# EAGLE design main (EAGLE 8.0.1)
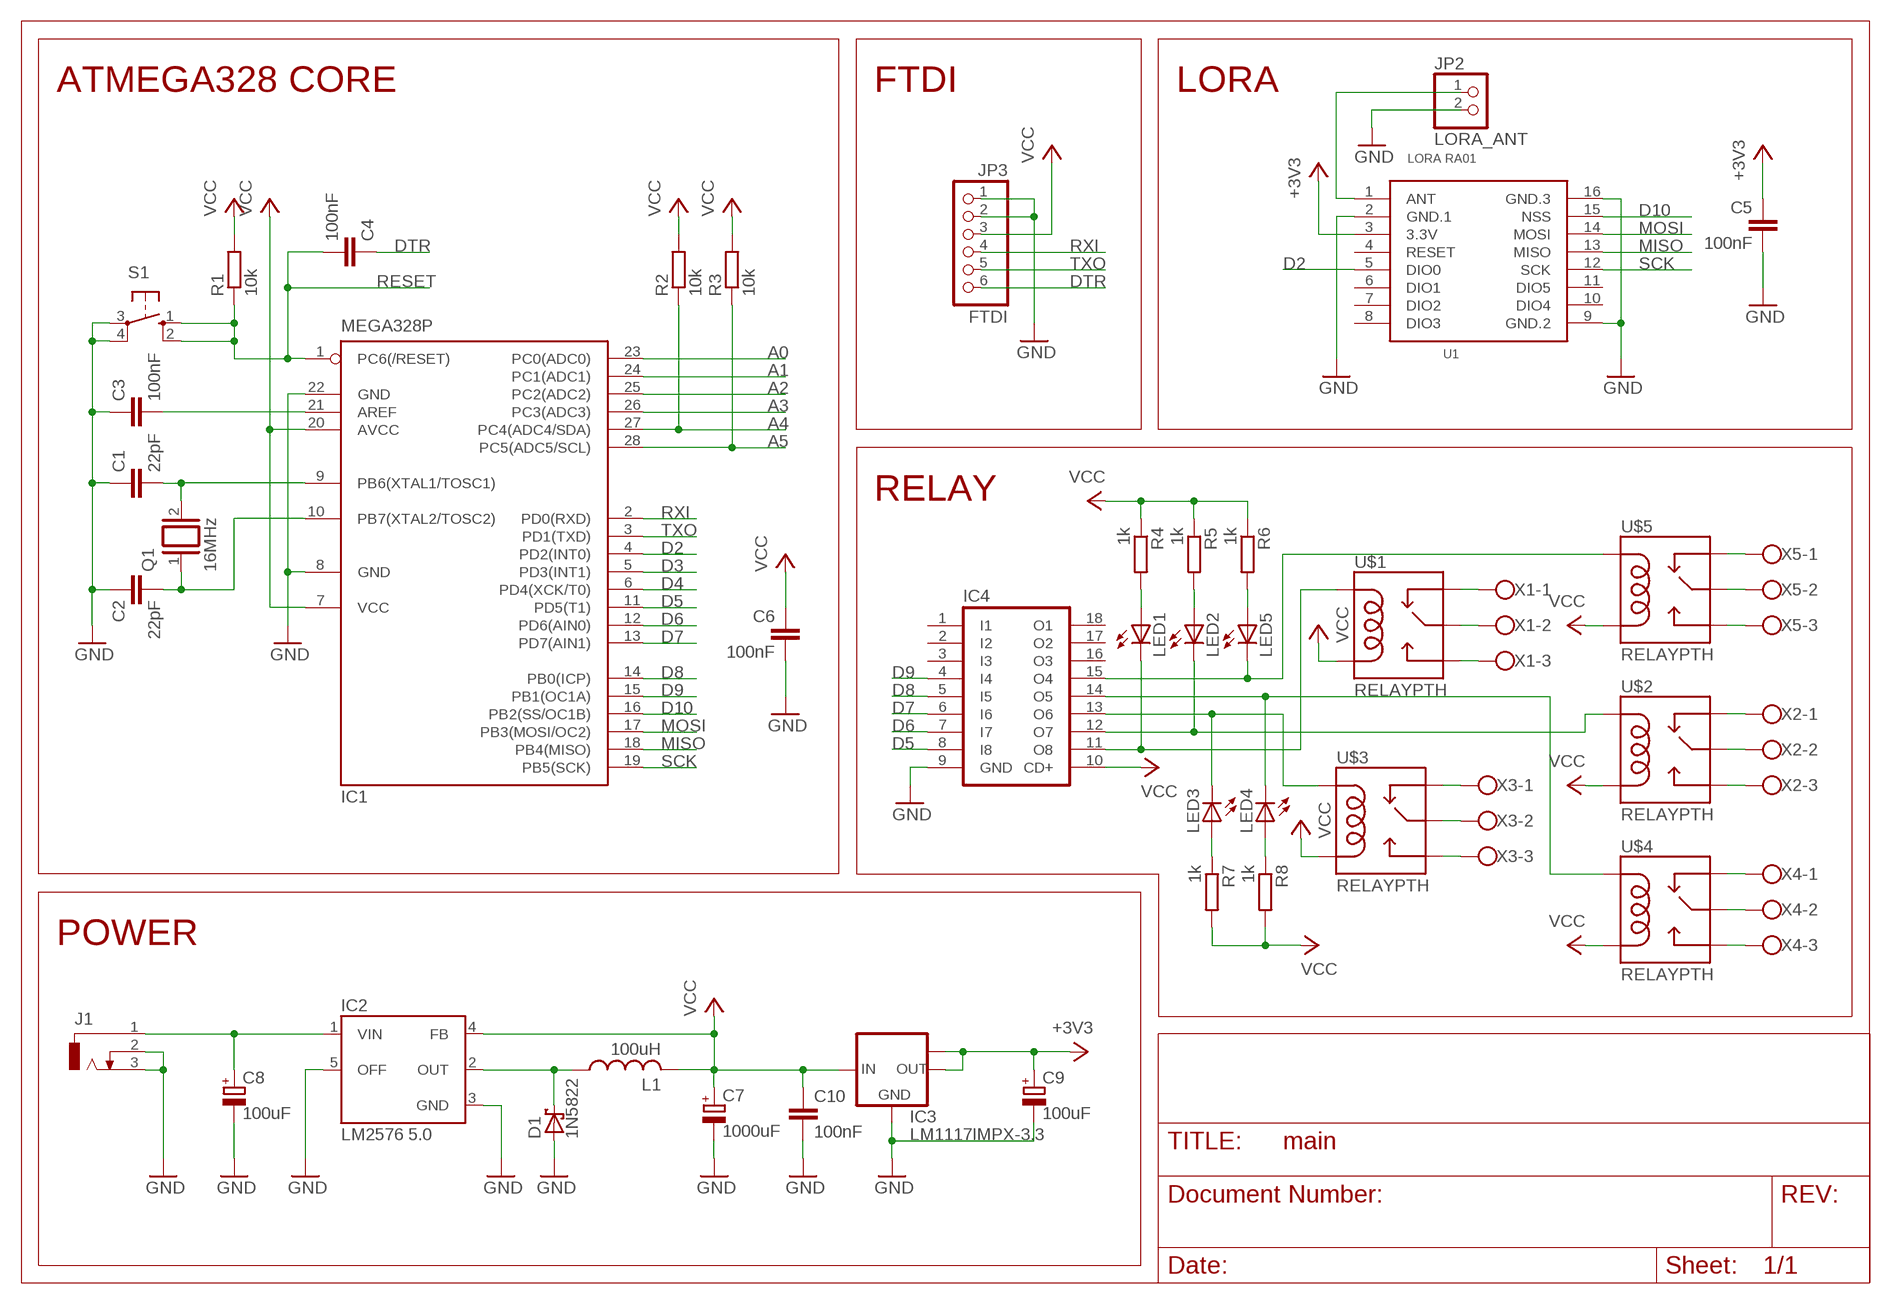
[diagram p0: schematic, sheet 1]

## Parts
C1  22pF  C-EU050-024X044  [C050-024X044]
C2  22pF  C-EU050-024X044  [C050-024X044]
C3  100nF  C-EU050-024X044  [C050-024X044]
C4  100nF  C-EU050-024X044  [C050-024X044]
C5  100nF  C-EU050-024X044  [C050-024X044]
C6  100nF  C-EU050-024X044  [C050-024X044]
C7  1000uF  CPOL-EUE5-13  [E5-13]
C8  100uF  CPOL-EUE5-8.5  [E5-8,5]
C9  100uF  CPOL-EUE3.5-10  [E3,5-10]
C10  100nF  C-EU050-024X044  [C050-024X044]
D1  1N5822  SCHOTTKY-DIODEDO201T15  [DO201T15]
IC1  MEGA328P  MEGA8-P  [DIL28-3]
IC2  LM2576 5.0  LM2576S  [TO263-5]
IC3  LM1117IMPX-3.3  [SOT223]
IC4  ULN2803A  [DIL18]
J1  DCJ0303  [DCJ0303]
JP2  LORA_ANT  PINHD-1X2  [1X02]
JP3  FTDI  PINHD-1X6  [1X06]
L1  100uH  L-US6000-XXX-RC  [6000-XXXX-RC]
LED1  LED3MM  [LED3MM]
LED2  LED3MM  [LED3MM]
LED3  LED3MM  [LED3MM]
LED4  LED3MM  [LED3MM]
LED5  LED3MM  [LED3MM]
Q1  16MHz  XTAL/S  [QS]
R1  10k  R-EU_0207/10  [0207/10]
R2  10k  R-EU_0207/10  [0207/10]
R3  10k  R-EU_0207/10  [0207/10]
R4  1k  R-EU_0207/10  [0207/10]
R5  1k  R-EU_0207/10  [0207/10]
R6  1k  R-EU_0207/10  [0207/10]
R7  1k  R-EU_0207/10  [0207/10]
R8  1k  R-EU_0207/10  [0207/10]
S1  10-XX  [B3F-10XX]
U1  LORA RA01  LORA-RA-01-433MHZ  [LORA-RA1-SMD]
U$1  RELAYPTH  [SRD-05VDC-SL-C]
U$2  RELAYPTH  [SRD-05VDC-SL-C]
U$3  RELAYPTH  [SRD-05VDC-SL-C]
U$4  RELAYPTH  [SRD-05VDC-SL-C]
U$5  RELAYPTH  [SRD-05VDC-SL-C]
X1  W237-103  [W237-103]
X2  W237-103  [W237-103]
X3  W237-103  [W237-103]
X4  W237-103  [W237-103]
X5  W237-103  [W237-103]

## Nets
+3V3: C5.1 C9.+ IC3.2(OUT) IC3.TAB(OUT1) U1.3(3.3V)
A0: IC1.23(PC0(ADC0))
A1: IC1.24(PC1(ADC1))
A2: IC1.25(PC2(ADC2))
A3: IC1.26(PC3(ADC3))
A4: IC1.27(PC4(ADC4/SDA)) R2.1
A5: IC1.28(PC5(ADC5/SCL)) R3.1
D2: IC1.4(PD2(INT0)) U1.5(DIO0)
D3: IC1.5(PD3(INT1))
D4: IC1.6(PD4(XCK/T0))
D5: IC1.11(PD5(T1)) IC4.8(I8)
D6: IC1.12(PD6(AIN0)) IC4.7(I7)
D7: IC1.13(PD7(AIN1)) IC4.6(I6)
D8: IC1.14(PB0(ICP)) IC4.5(I5)
D9: IC1.15(PB1(OC1A)) IC4.4(I4)
D10: IC1.16(PB2(SS/OC1B)) U1.15(NSS)
DTR: C4.1 JP3.6
GND: C1.1 C2.1 C3.1 C5.2 C6.2 C7.- C8.- C9.- C10.2 D1.A IC1.8(GND) IC1.22(GND) IC2.3(GND) IC2.5(OFF) IC3.1(GND) IC4.9(GND) J1.2 J1.3 JP2.2 JP3.1 JP3.2 S1.3(P) S1.4(P1) U1.2(GND.1) U1.9(GND.2) U1.16(GND.3)
MISO: IC1.18(PB4(MISO)) U1.13(MISO)
MOSI: IC1.17(PB3(MOSI/OC2)) U1.14(MOSI)
N$1: JP2.1 U1.1(ANT)
N$5: C1.2 IC1.9(PB6(XTAL1/TOSC1)) Q1.2
N$6: C2.2 IC1.10(PB7(XTAL2/TOSC2)) Q1.1
N$8: C3.2 IC1.21(AREF)
N$9: C8.+ IC2.1(VIN) J1.1
N$10: D1.C IC2.2(OUT) L1.1
N$11: U$1.SWCLOSED(SWCLOSE) X1.1
N$12: U$1.SWCOMMON X1.2
N$13: U$1.SWOPEN X1.3
N$14: U$3.SWCOMMON X3.2
N$15: U$3.SWCLOSED(SWCLOSE) X3.1
N$16: U$3.SWOPEN X3.3
N$17: U$4.SWCLOSED(SWCLOSE) X4.1
N$18: U$4.SWCOMMON X4.2
N$19: U$4.SWOPEN X4.3
N$20: U$2.SWOPEN X2.3
N$21: U$2.SWCLOSED(SWCLOSE) X2.1
N$22: U$2.SWCOMMON X2.2
N$23: IC4.11(O8) LED1.K(C) U$1.COIL1
N$24: IC4.12(O7) LED2.K(C) U$2.COIL1
N$25: IC4.13(O6) LED3.K(C) U$3.COIL1
N$26: IC4.14(O5) LED4.K(C) U$4.COIL1
N$27: U$5.SWCLOSED(SWCLOSE) X5.1
N$28: U$5.SWOPEN X5.3
N$29: U$5.SWCOMMON X5.2
N$30: IC4.15(O4) LED5.K(C) U$5.COIL1
N$32: LED1.A R4.2
N$33: LED2.A R5.2
N$34: LED5.A R6.2
N$36: LED3.A R7.1
N$37: LED4.A R8.1
RESET: C4.2 IC1.1(PC6(/RESET)) R1.1 S1.1(S) S1.2(S1)
RXI: IC1.2(PD0(RXD)) JP3.4
SCK: IC1.19(PB5(SCK)) U1.12(SCK)
TXO: IC1.3(PD1(TXD)) JP3.5
VCC: C6.1 C7.+ C10.1 IC1.7(VCC) IC1.20(AVCC) IC2.4(FB) IC3.3(IN) IC4.10(CD+) JP3.3 L1.2 R1.2 R2.2 R3.2 R4.1 R5.1 R6.1 R7.2 R8.2 U$1.COIL0 U$2.COIL0 U$3.COIL0 U$4.COIL0 U$5.COIL0
Unconnected: IC4.1(I1) IC4.2(I2) IC4.3(I3) IC4.16(O3) IC4.17(O2) IC4.18(O1) U1.4(RESET) U1.6(DIO1) U1.7(DIO2) U1.8(DIO3) U1.10(DIO4) U1.11(DIO5)

## Notes on the sheet
- ATMEGA328 CORE | FTDI | LORA
- RELAY
- POWER

## Library data of the parts
C1-C6 C10 = rcl:C-EU: CAPACITOR, European symbol
C7-C9 = rcl:CPOL-EU: POLARIZED CAPACITOR, European symbol
D1 = diode:SCHOTTKY-DIODE: Schottky Diode
IC1 = atmel:MEGA8-P: MICROCONTROLLER 8 Kbytes FLASH, 1 kbytes SRAM, 512 bytes EEPROM, USART, 4-channel 10 bit ADC, 2-channel 8 bit ADC Pin compatible with Atmega48, ATMega88, ATMega168 Source: avr.lbr; OC_FARNELL: unknown; OC_NEWARK: unknown
IC2 = lm2576:LM2576: National Semiconductor <http://www.national.com> 3.0A "Simple Switcher"(c) 52kHz, Vout 1.23-37V (HV: 57V), Vin 40V (HV: 60V), 50µA standby current
IC3 = lm1117:LM1117IMPX-*
IC4 = uln-udn:ULN2803A: DRIVER ARRAY
J1 = con-jack:DCJ0303: DC POWER JACK Source: DCJ0303.pdf; OC_FARNELL: unknown; OC_NEWARK: unknown
JP2 = pinhead:PINHD-1X2: PIN HEADER
JP3 = pinhead:PINHD-1X6: PIN HEADER
L1 = rcl:L-US: INDUCTOR, American symbol
LED1-LED5 = led:LED: LED OSRAM: - CHIPLED LG R971, LG N971, LY N971, LG Q971, LY Q971, LO R971, LY R971 LH N974, LH R974 LS Q976, LO Q976, LY Q976 LO Q996 - Hyper CHIPLED LW Q18S LB Q993, LB Q99A, LB R99A - SideLED LS A670, LO A670, LY A670, LG A670, LP A670 LB A673, LV A673, LT A673, LW A673 LH A674 LY A675 LS A676, LA A676, LO A676, LY A676, LW A676 LS A679, LY A679, LG A679 - Hyper Micro SIDELED® LS Y876, LA Y876, LO Y876, LY Y876 LT Y87S - SmartLED LW L88C, LW L88S LB L89C, LB L89S, LG L890 LS L89K, LO L89K, LY L89K LS L896, LA L896, LO L896, LY L896 - TOPLED LS T670, LO T670, LY T670, LG T670, LP T670 LSG T670, LSP T670, LSY T670, LOP T670, LYG T670 LG T671, LOG T671, LSG T671 LB T673, LV T673, LT T673, LW T673 LH T674 LS T676, LA T676, LO T676, LY T676, LB T676, LH T676, LSB T676, LW T676 LB T67C, LV T67C, LT T67C, LS T67K, LO T67K, LY T67K, LW E67C LS E67B, LA E67B, LO E67B, LY E67B, LB E67C, LV E67C, LT E67C LW T67C LS T679, LY T679, LG T679 LS T770, LO T770, LY T770, LG T770, LP T770 LB T773, LV T773, LT T773, LW T773 LH T774 LS E675, LA E675, LY E675, LS T675 LS T776, LA T776, LO T776, LY T776, LB T776 LHGB T686 LT T68C, LB T68C - Hyper Mini TOPLED® LB M676 - Mini TOPLED Santana® LG M470 LS M47K, LO M47K, LY M47K Source: http://www.osram.convergy.de LUXEON: - LUMILED® LXK2-PW12-R00, LXK2-PW12-S00, LXK2-PW14-U00, LXK2-PW14-V00 LXK2-PM12-R00, LXK2-PM12-S00, LXK2-PM14-U00 LXK2-PE12-Q00, LXK2-PE12-R00, LXK2-PE12-S00, LXK2-PE14-T00, LXK2-PE14-U00 LXK2-PB12-K00, LXK2-PB12-L00, LXK2-PB12-M00, LXK2-PB14-N00, LXK2-PB14-P00, LXK2-PB14-Q00 LXK2-PR12-L00, LXK2-PR12-M00, LXK2-PR14-Q00, LXK2-PR14-R00 LXK2-PD12-Q00, LXK2-PD12-R00, LXK2-PD12-S00 LXK2-PH12-R00, LXK2-PH12-S00 LXK2-PL12-P00, LXK2-PL12-Q00, LXK2-PL12-R00 Source: www.luxeon.com KINGBRIGHT: KA-3528ASYC Source: www.kingbright.com
Q1 = special:XTAL/S: CRYSTAL
R1-R8 = rcl:R-EU_: RESISTOR, European symbol
S1 = switch-omron:10-XX: OMRON SWITCH; MPN: B3F-1000; OC_FARNELL: 176432; OC_NEWARK: 36M3542
U1 = lora:LORA-RA-01-433MHZ: 433 MHz Lora Ra-01 Radio Transceiver Module based on SX1278 chip.
U$1-U$5 = songle:RELAY: SPDT relay (COM-00101)
X1-X5 = con-wago-500:W237-103: WAGO SCREW CLAMP; MPN: 237-103; OC_FARNELL: unknown; OC_NEWARK: 18M7116

## Board
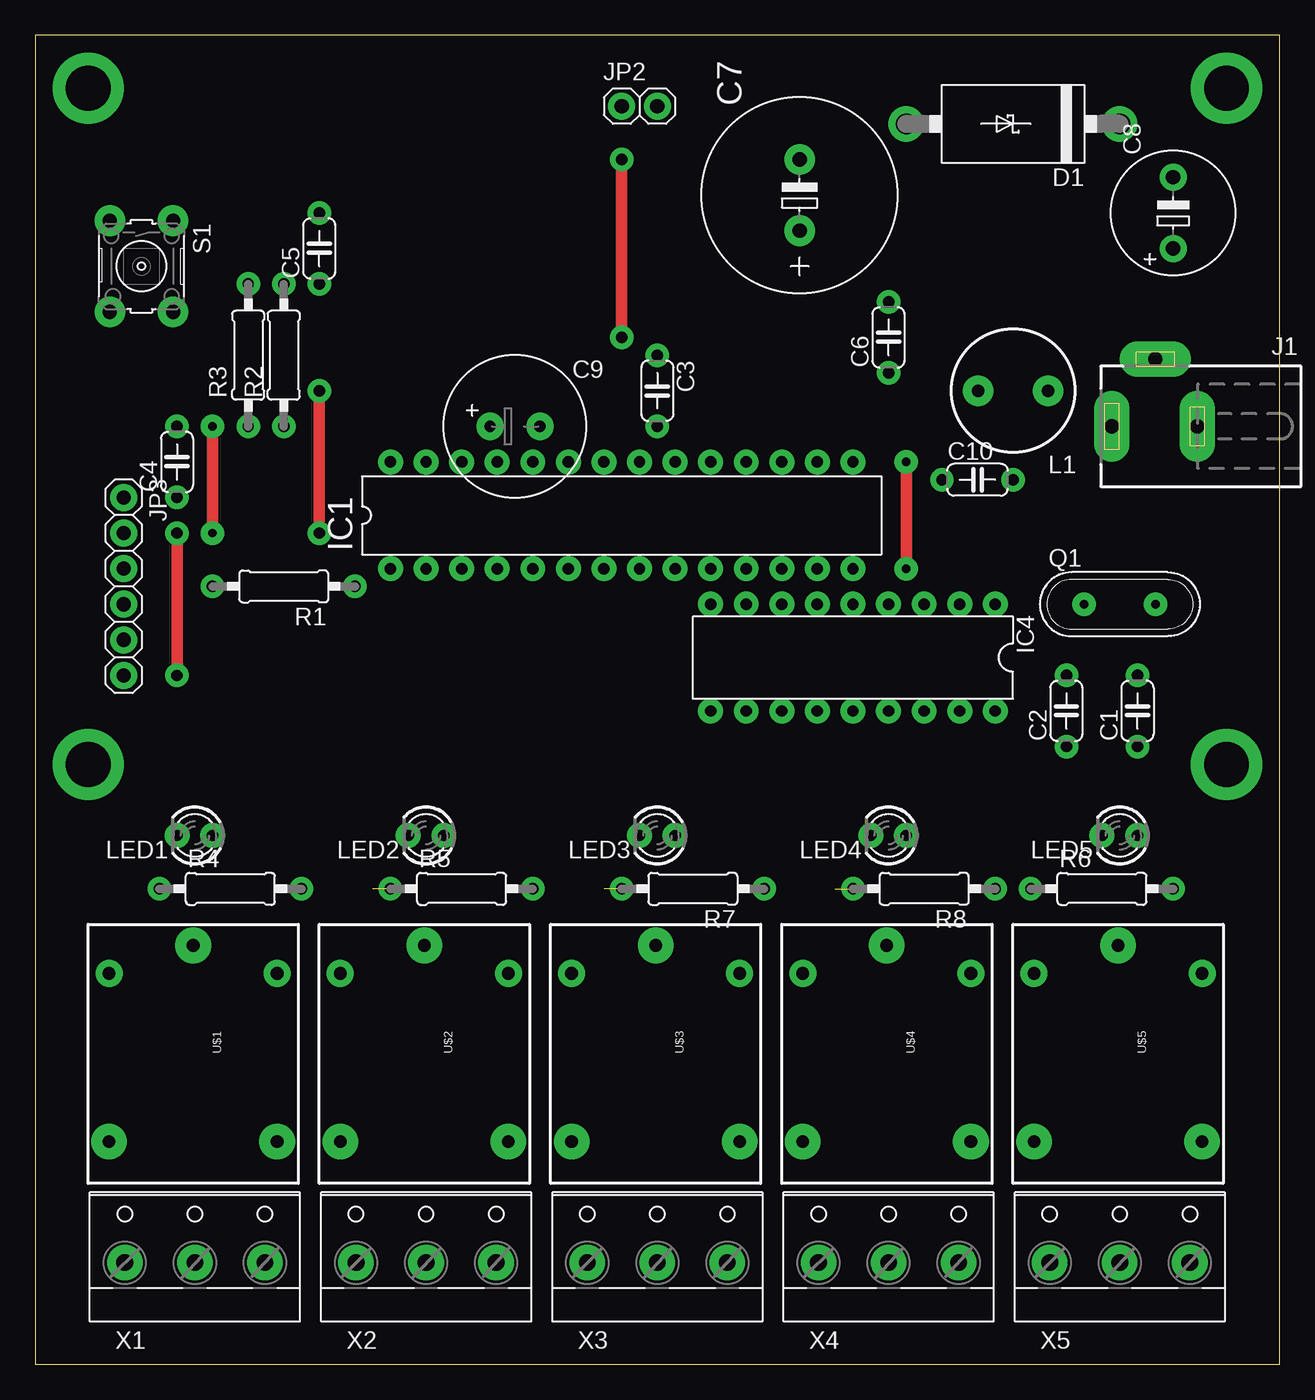
[diagram p1: board, top side]
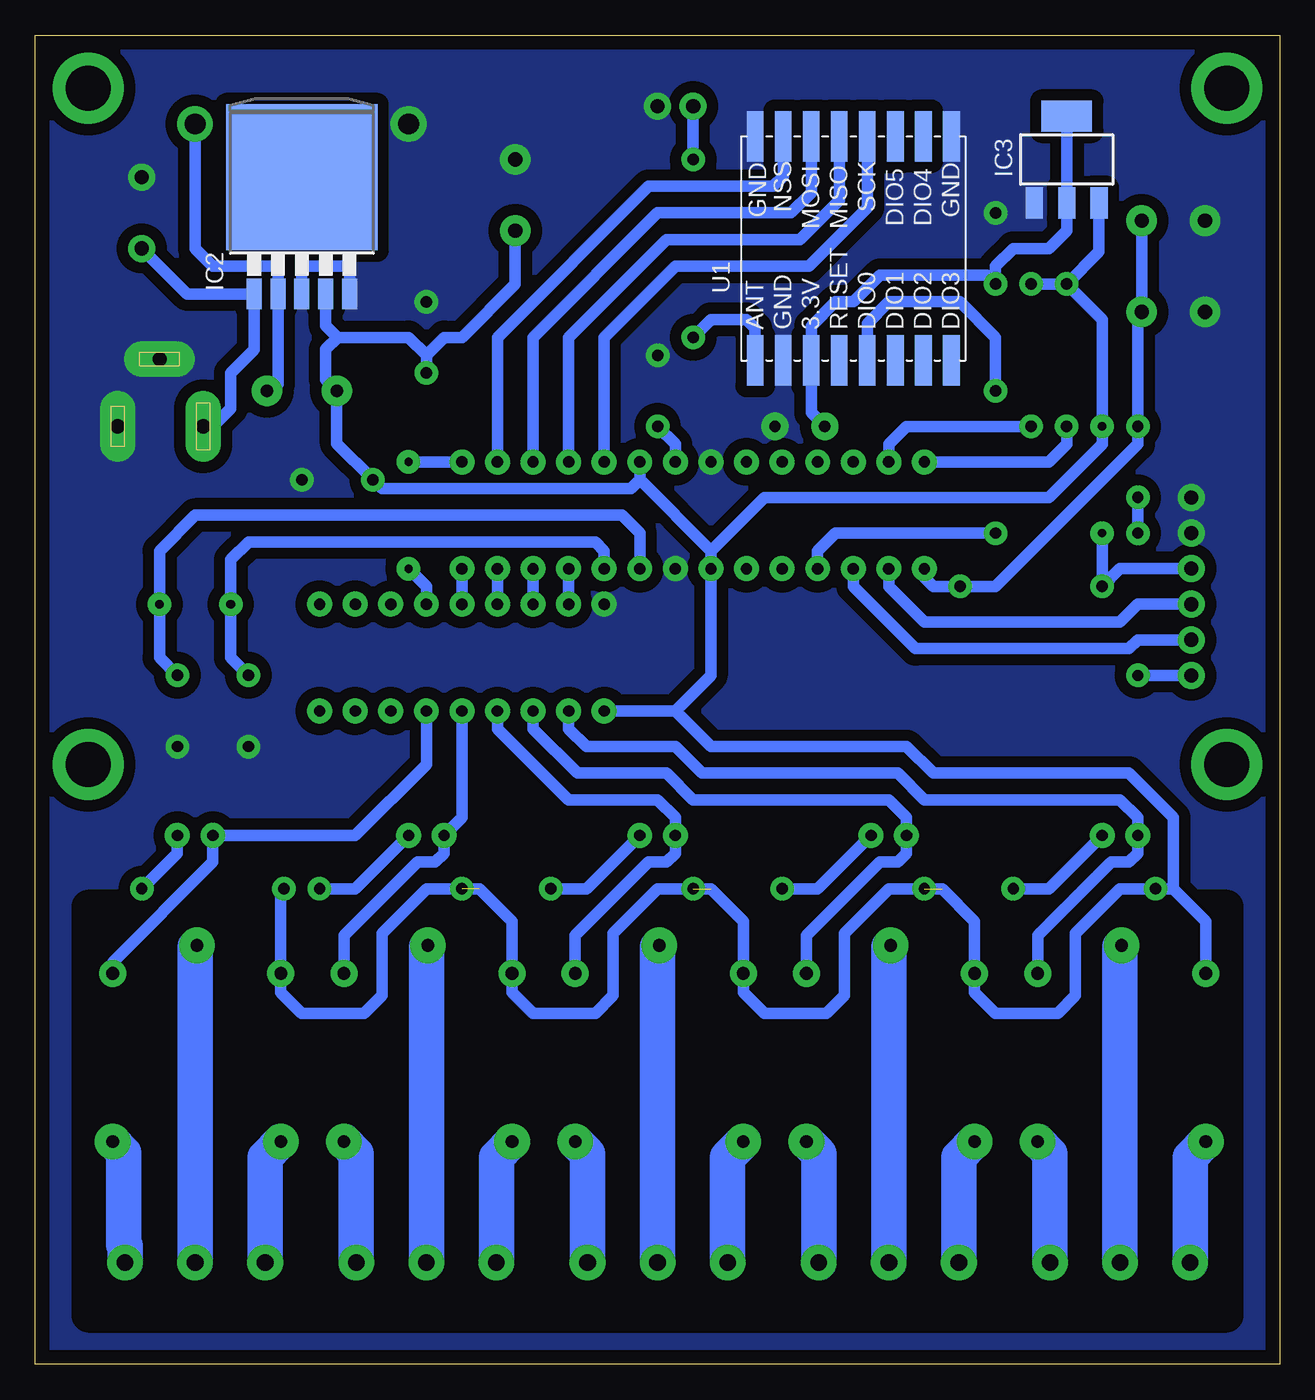
[diagram p2: board, bottom side, seen from below]

Size 88.88 x 94.92 mm. Coordinates in mm from the lower left corner, seen from the top.
Outline: 88.88,94.92 0,94.92 0,0 88.88,0 88.88,94.92
Copper layers (1*16): Top 0.035mm / dielectric 1.5mm / Bottom 0.035mm
Design rules "default": minimum track width 10mil, minimum drill 24mil, track to track 8mil, track to pad 8mil, pad to pad 8mil, via to via 8mil, smd to smd 8mil, copper to edge 40mil, drill to drill 8mil, minimum pad ring 10mil, minimum via ring 8mil, stop-mask expansion 4mil, vias tented up to drill 0mil, thermal gap 10mil
bRestrict: 4 lines

### Footprints (pad centres in the part's own frame; a part is rotated, then mirrored left to right if it is on the bottom)
C050-024X044 = drill 0.813 pad 1.676: 1 -2.54,0; 2 2.54,0
E5-13 = drill 1.016 pad 2.184: + -2.54,0; - 2.54,0
E5-8,5 = drill 1.016 pad 1.93: + -2.54,0; - 2.54,0
E3,5-10 = drill 0.813 pad 1.93: + -1.778,0; - 1.778,0
DO201T15 = drill 1.499 pad 2.54: A 7.62,0; C -7.62,0
DIL28-3 = drill 0.813 pad 1.778: 1 -16.51,-3.81; 2 -13.97,-3.81; 3 -11.43,-3.81; 4 -8.89,-3.81; 5 -6.35,-3.81; 6 -3.81,-3.81; 7 -1.27,-3.81; 8 1.27,-3.81; 9 3.81,-3.81; 10 6.35,-3.81; 11 8.89,-3.81; 12 11.43,-3.81; 13 13.97,-3.81; 14 16.51,-3.81; 15 16.51,3.81; 16 13.97,3.81; 17 11.43,3.81; 18 8.89,3.81; 19 6.35,3.81; 20 3.81,3.81; 21 1.27,3.81; 22 -1.27,3.81; 23 -3.81,3.81; 24 -6.35,3.81; 25 -8.89,3.81; 26 -11.43,3.81; 27 -13.97,3.81; 28 -16.51,3.81
TO263-5 = smd 1.067 x 2.159: 1 -3.404,-5.791; 2 -1.702,-5.791; 3 0,-5.791; 4 1.702,-5.791; 5 3.404,-5.791 | smd 10.8 x 10.41: 6 0,2.54
SOT223 = smd 1.219 x 2.235: 1 -2.311,-3.099; 2 0,-3.099; 3 2.311,-3.099 | smd 3.6 x 2.2: TAB 0,3.099
DIL18 = drill 0.813 pad 1.778: 1 -10.16,-3.81; 2 -7.62,-3.81; 3 -5.08,-3.81; 4 -2.54,-3.81; 5 0,-3.81; 6 2.54,-3.81; 7 5.08,-3.81; 8 7.62,-3.81; 9 10.16,-3.81; 10 10.16,3.81; 11 7.62,3.81; 12 5.08,3.81; 13 2.54,3.81; 14 0,3.81; 15 -2.54,3.81; 16 -5.08,3.81; 17 -7.62,3.81; 18 -10.16,3.81
DCJ0303 = drill 1 pad 2.54 long: 1 0,3.1; 2 4.8,0; 3 0,-3
1X02 = drill 1.016 pad 1.93: 1 -1.27,0; 2 1.27,0
1X06 = drill 1.016 pad 1.93: 1 -6.35,0; 2 -3.81,0; 3 -1.27,0; 4 1.27,0; 5 3.81,0; 6 6.35,0
6000-XXXX-RC = drill 0.9 pad 2.184: 1 -2.5,0; 2 2.5,0
LED3MM = drill 0.813 pad 1.778: A -1.27,0; K 1.27,0
QS = drill 0.61 pad 1.676: 1 -2.54,0; 2 2.54,0
0207/10 = drill 0.813 pad 1.676: 1 -5.08,0; 2 5.08,0
B3F-10XX = drill 1.016 pad 2.184: 1 -3.251,2.261; 2 3.251,2.261; 3 -3.251,-2.261; 4 3.251,-2.261
LORA-RA1-SMD = smd 3.6 x 1.2: 1 -8,7; 2 -8,5; 3 -8,3; 4 -8,1; 5 -8,-1; 6 -8,-3; 7 -8,-5; 8 -8,-7; 9 8,-7; 10 8,-5; 11 8,-3; 12 8,-1; 13 8,1; 14 8,3; 15 8,5; 16 8,7
SRD-05VDC-SL-C = drill 0.9 pad 1.93: COIL0 -5.39,-6.12; COIL1 -5.39,5.88 | drill 0.9 pad 2.54: SWCLOSED 6.61,-6.12; SWCOMMON -7.39,-0.12; SWOPEN 6.61,5.88
W237-103 = drill 1.194 pad 2.54: 1 -5,-1.29; 2 0,-1.29; 3 5,-1.29

### Placement (x,y rotation side)
C1  78.72,46.66 90 top
C2  73.64,46.66 90 top
C3  44.43,69.52 270 top
C4  10.14,64.44 90 top
C5  20.3,79.68 90 top
C6  60.94,73.33 90 top
C7  54.59,83.49 90 top
C8  81.26,82.22 90 top
C9  34.27,66.98 0 top
C10  67.29,63.17 0 top
D1  69.83,88.57 180 top
IC1  41.89,60.63 0 top
IC2  69.83,82.22 0 bottom
IC3  15.22,86.03 0 bottom
IC4  58.4,50.47 180 top
J1  79.99,66.98 90 top
JP2  43.16,89.84 0 top
JP3  6.33,55.55 270 top
L1  69.83,69.52 180 top
LED1  11.41,37.77 180 top
LED2  27.92,37.77 180 top
LED3  44.43,37.77 180 top
LED4  60.94,37.77 180 top
LED5  77.45,37.77 180 top
Q1  77.45,54.28 0 top
R1  17.76,55.55 180 top
R2  17.76,72.06 90 top
R3  15.22,72.06 90 top
R4  13.95,33.96 0 top
R5  30.46,33.96 0 top
R6  76.18,33.96 0 top
R7  46.97,33.96 180 top
R8  63.48,33.96 180 top
S1  7.6,78.41 270 top
U1  30.46,79.68 90 bottom
U$1  11.41,22.53 270 top
U$2  27.92,22.53 270 top
U$3  44.43,22.53 270 top
U$4  60.94,22.53 270 top
U$5  77.45,22.53 270 top
X1  11.41,8.56 0 top
X2  27.92,8.56 0 top
X3  44.43,8.56 0 top
X4  60.94,8.56 0 top
X5  77.45,8.56 0 top

### Tracks (layer width: path | path; a pad name or v marks a point on that pad's centre or on a via)
+3V3
  Bottom 0.813: C9.+ 33.46,67.95 U1.3 33.46,74.14 31.73,75.87 30.46,75.87 28.55,77.78 20.93,77.78 C5.1 20.3,78.41 19.03,79.68 16.49,79.68 15.22,80.95 IC3.2 IC3.TAB
A4
  Bottom 0.813: IC1.27 27.92,65.71 26.65,66.98 R2.1
A5
  Bottom 0.813: R3.1 15.22,65.71 16.49,64.44 IC1.28
D2  (via drill 0.8 pad 1.68)
  Top 0.813: v20.3,59.36 v20.3,69.52
  Bottom 0.813: IC1.4 33,58.09 31.73,59.36 v20.3,59.36 | U1.5 29.46,74.33 27.92,75.87 22.84,75.87 20.3,73.33 v20.3,69.52
D5
  Bottom 0.813: IC1.11 IC4.8
D6
  Bottom 0.813: IC1.12 IC4.7
D7
  Bottom 0.813: IC1.13 IC4.6
D8
  Bottom 0.813: IC1.14 IC4.5
D9  (via drill 0.6 pad 1.68)
  Top 0.813: v62.21,64.44 v62.21,56.82
  Bottom 0.813: IC1.15 v62.21,64.44 | v62.21,56.82 60.94,55.55 IC4.4
D10
  Bottom 0.813: IC1.16 55.86,73.33 45.06,84.12 36.17,84.12 35.46,84.84 U1.15
DTR  (via drill 0.8 pad 1.68)
  Top 0.813: v10.14,49.2 v10.14,59.36
  Bottom 0.813: JP3.6 v10.14,49.2 | v10.14,59.36 C4.1
GND
  Bottom 0.813: IC2.3 69.83,78.41 66.43,78.41 IC2.5
  pour Bottom (isolate 0.813, no thermals): 88.88,-0.33 -0.02,-0.33 -0.02,94.92 88.88,94.92
MISO
  Bottom 0.813: IC1.18 50.78,73.33 43.79,80.31 34.27,80.31 31.46,83.12 U1.13
MOSI
  Bottom 0.813: IC1.17 53.32,73.33 44.43,82.22 34.9,82.22 33.46,83.67 U1.14
N$1  (via drill 0.8 pad 1.68)
  Top 0.813: v41.89,73.33 v41.89,86.03
  Bottom 0.813: U1.1 37.46,73.98 38.08,74.6 40.62,74.6 v41.89,73.33 | v41.89,86.03 JP2.1
N$2  (via drill 3.2 pad 5.08)
  other vias: 85.07,91.11
N$3  (via drill 3.2 pad 5.08)
  other vias: 3.79,91.11
N$4  (via drill 3.2 pad 5.08)
  other vias: 85.07,42.85
N$5
  Bottom 0.813: IC1.9 45.7,59.36 46.97,60.63 77.45,60.63 79.99,58.09 Q1.2 79.99,50.47 C1.2
N$6
  Bottom 0.813: IC1.10 48.24,58.09 48.88,58.73 73.64,58.73 74.91,57.45 Q1.1 74.91,50.47 C2.2
N$7  (via drill 3.2 pad 5.08)
  other vias: 3.79,42.85
N$8
  Bottom 0.813: IC1.21 43.16,65.71 C3.2
N$9
  Bottom 0.813: C8.+ 78.01,76.43 IC2.1 73.23,72.47 74.91,70.79 74.91,68.25 76.18,66.98 J1.1
N$10
  Bottom 0.813: L1.1 71.53,69.99 IC2.2 71.53,78.41 76.18,78.41 77.45,79.68 D1.C
N$11
  Bottom 2.54: U$1.SWCLOSED 6.41,14.8 X1.1
N$12
  Bottom 2.54: U$1.SWCOMMON 11.41,29.8 X1.2
N$13
  Bottom 2.54: U$1.SWOPEN 16.41,15.04 X1.3
N$14
  Bottom 2.54: U$3.SWCOMMON 44.43,29.8 X3.2
N$15
  Bottom 2.54: U$3.SWCLOSED 39.43,14.8 X3.1
N$16
  Bottom 2.54: U$3.SWOPEN 49.43,15.04 X3.3
N$17
  Bottom 2.54: U$4.SWCLOSED 55.94,14.8 X4.1
N$18
  Bottom 2.54: U$4.SWCOMMON 60.94,29.8 X4.2
N$19
  Bottom 2.54: U$4.SWOPEN 65.94,15.04 X4.3
N$20
  Bottom 2.54: U$2.SWOPEN 32.92,15.04 X2.3
N$21
  Bottom 2.54: U$2.SWCLOSED 22.92,14.8 X2.1
N$22
  Bottom 2.54: U$2.SWCOMMON 27.92,29.8 X2.2
N$23
  Bottom 0.813: U$1.COIL1 17.29,30.62 12.04,35.87 10.78,35.87 10.14,36.5 LED1.K 10.14,39.04 11.41,40.31 25.38,40.31 27.29,42.22 41.25,42.22 43.16,44.12 49.51,44.12 50.78,45.39 IC4.11
N$24
  Bottom 0.813: U$2.COIL1 33.8,30.62 28.55,35.87 27.29,35.87 26.65,36.5 LED2.K 26.65,39.04 27.92,40.31 41.89,40.31 43.79,42.22 50.14,42.22 53.32,45.39 IC4.12
N$25
  Bottom 0.813: U$3.COIL1 50.31,30.62 45.06,35.87 43.79,35.87 43.16,36.5 LED3.K 43.16,39.04 44.43,40.31 50.78,40.31 55.86,45.39 IC4.13
N$26
  Bottom 0.813: U$4.COIL1 66.82,30.62 61.57,35.87 60.3,35.87 59.67,36.5 LED4.K 58.4,39.04 IC4.14
N$27
  Bottom 2.54: U$5.SWCLOSED 72.45,14.8 X5.1
N$28
  Bottom 2.54: U$5.SWOPEN 82.53,15.12 82.53,8.56 82.45,8.48 X5.3
N$29
  Bottom 2.54: U$5.SWCOMMON 77.45,29.8 X5.2
N$30
  Bottom 0.813: U$5.COIL1 83.33,28.72 76.18,35.87 LED5.K 66.02,37.77 60.94,42.85 IC4.15
N$32
  Bottom 0.813: LED1.A 16.49,33.96 R4.2
N$33
  Bottom 0.813: LED2.A 33,33.96 R5.2
N$34
  Bottom 0.813: LED5.A 78.72,36.5 R6.2
N$36
  Bottom 0.813: LED3.A 49.51,33.96 R7.1
N$37
  Bottom 0.813: LED4.A 66.02,33.96 R8.1
RESET
  Bottom 0.813: S1.1 S1.2 | S1.2 9.86,74.88 10.14,74.6 | 10.14,74.6 10.14,74.88 S1.2 | 10.14,74.6 C4.2 10.14,65.71 20.3,55.55 R1.1 24.75,55.55 25.38,56.19 IC1.1
RXI
  Bottom 0.813: IC1.2 27.92,55.55 25.38,53.01 11.41,53.01 10.14,54.28 JP3.4
SCK
  Bottom 0.813: IC1.19 48.24,73.33 43.16,78.41 33.63,78.41 29.46,82.59 U1.12
TXO
  Bottom 0.813: IC1.3 30.46,55.55 26.02,51.11 10.78,51.11 10.14,51.74 JP3.5
VCC  (via drill 0.6 pad 1.68)  (3 unrouted)
  Top 0.813: v12.68,66.98 v12.68,59.36
  Bottom 0.813: L1.2 68.13,70.32 68.13,72.49 67.29,73.33 | IC2.4 68.13,74.17 67.29,73.33 | 40.62,58.09 IC1.7 40.62,49.2 43.16,46.66 | 45.7,63.17 40.62,58.09 | 45.7,63.17 IC1.20 | 45.7,63.17 46.33,62.54 64.12,62.54 C10.1 67.33,65.75 L1.2 | C7.+ 54.59,77.14 58.4,73.33 59.67,73.33 60.94,72.06 | 67.29,73.33 62.21,73.33 60.94,72.06 | 60.94,72.06 C6.1 | 67.29,69.48 L1.2 | 40.62,58.09 36.81,61.9 16.49,61.9 12.68,65.71 v12.68,66.98 12.68,74.6 R3.2 | IC3.3 12.91,79.45 R3.2 | R3.2 R2.2 | v12.68,59.36 R1.2 11.41,56.82 JP3.3 | 7.6,33.96 R4.1 11.41,33.96 14.59,30.79 14.59,26.34 15.86,25.07 20.3,25.07 21.8,26.57 U$2.COIL0 21.8,31.65 24.11,33.96 27.92,33.96 31.09,30.79 31.09,26.34 32.36,25.07 36.81,25.07 38.31,26.57 U$3.COIL0 38.31,31.65 40.62,33.96 44.43,33.96 47.6,30.79 47.6,26.34 48.88,25.07 53.32,25.07 54.82,26.57 U$4.COIL0 54.82,31.65 57.13,33.96 60.94,33.96 64.12,30.79 64.12,26.34 65.39,25.07 69.83,25.07 71.33,26.57 U$5.COIL0 71.33,33.73 R6.1 | 7.6,33.96 5.29,31.65 U$1.COIL0 | 7.6,33.96 7.6,39.04 10.78,42.22 24.75,42.22 26.65,44.12 40.62,44.12 43.16,46.66 | IC4.10 43.16,46.66